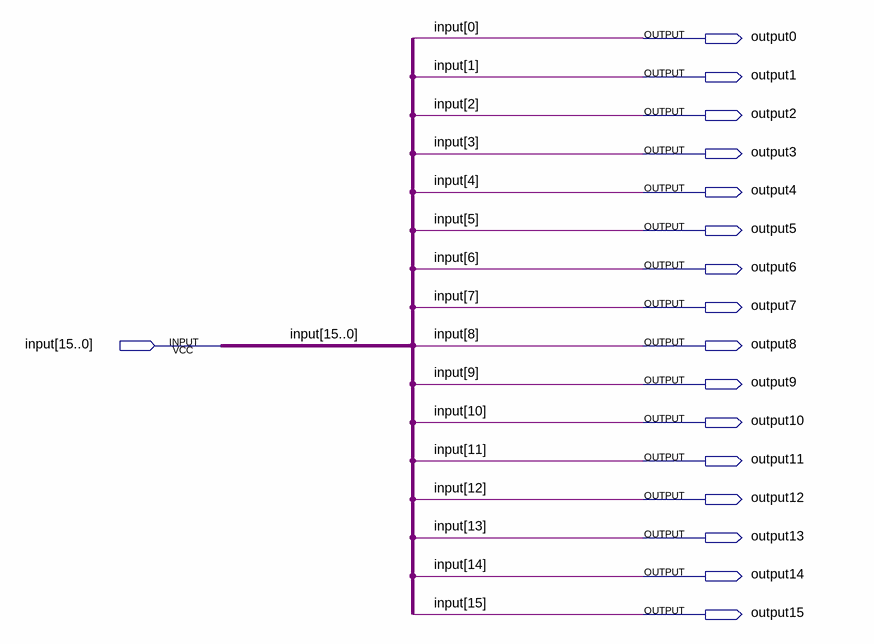
[diagram p0: schematic sheet]
// Quartus schematic unbind.bdf as structural Verilog: 0 symbols, 17 pins
module unbind (
  input  [15:0] \input ,
  output output0,
  output output1,
  output output2,
  output output3,
  output output4,
  output output5,
  output output6,
  output output7,
  output output8,
  output output9,
  output output10,
  output output11,
  output output12,
  output output13,
  output output14,
  output output15
);


  assign output0 = \input [0];
  assign output1 = \input [1];
  assign output2 = \input [2];
  assign output3 = \input [3];
  assign output4 = \input [4];
  assign output5 = \input [5];
  assign output6 = \input [6];
  assign output7 = \input [7];
  assign output8 = \input [8];
  assign output9 = \input [9];
  assign output10 = \input [10];
  assign output11 = \input [11];
  assign output12 = \input [12];
  assign output13 = \input [13];
  assign output14 = \input [14];
  assign output15 = \input [15];
endmodule
